# Altium schematic sheet Light_Circuit.SchDoc
size A
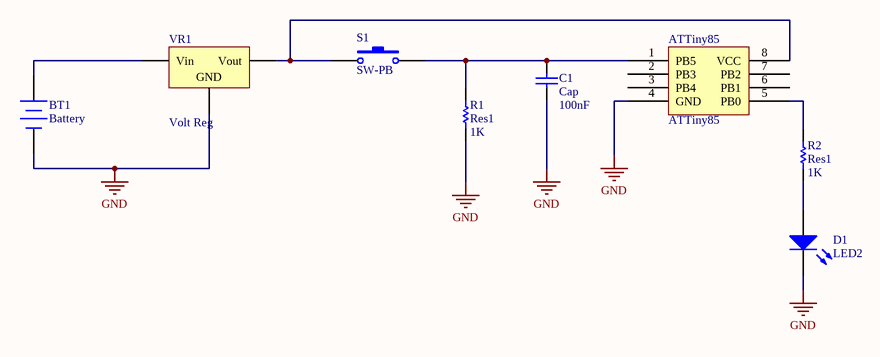
[diagram p0: Light_Circuit.SchDoc]

## Parts
ATTiny85  ATTiny85  [8S2]
BT1  Battery  [BAT-2]
C1  Cap  value 100nF  [RAD-0.3]
D1  LED2  [3.2X1.6X1.1]
R1  Res1  value 1K  [AXIAL-0.3]
R2  Res1  value 1K  [AXIAL-0.3]
S1  SW-PB  [SPST-2]
VR1  Volt Reg  [D2PAK_N]

## Nets
GND: ATTiny85.4(GND) BT1.2(-) C1.2 D1.2(K) R1.1 VR1.2(GND)
NetATTiny85_1: ATTiny85.1(PB5) C1.1 R1.2 S1.2
NetATTiny85_5: ATTiny85.5(PB0) R2.2
NetATTiny85_8: ATTiny85.8(VCC) S1.1 VR1.3(Vout)
NetBT1_1: BT1.1(+) VR1.1(Vin)
NetD1_1: D1.1(A) R2.1

Not connected (* = marked no-connect by the designer): ATTiny85 2(PB3) 3(PB4) 6(PB1) 7(PB2)

## Library data of the parts
ATTiny85 = ATTiny85_1
BT1 = Battery: Multicell Battery; Published: 24-Mar-1999; LatestRevisionDate: 17-Jul-2002; LatestRevisionNote: Re-released for DXP Platform.; PackageReference: BAT-2; Publisher: Altium Limited; PackageDescription: Battery; 2 Leads
C1 = Cap: Capacitor; Published: 8-Jun-2000; LatestRevisionDate: 17-Jul-2002; LatestRevisionNote: Re-released for DXP Platform.; PackageReference: RAD-0.3; Publisher: Altium Limited; PackageDescription: Radial Cap, Thru-Hole; 2 Leads; 0.3 in Pin Spacing
D1 = LED2: Typical RED, GREEN, YELLOW, AMBER GaAs LED; Published: 8-Jun-2000; LatestRevisionDate: 17-Jul-2002; LatestRevisionNote: Re-released for DXP Platform.; PackageVersion: Feb-2002; PackageReference: 3.2X1.6X1.1; Publisher: Altium Limited; PackageDescription: SM LED; 2 Flat Leads
R1 R2 = Res1: Resistor; Published: 8-Jun-2000; LatestRevisionDate: 17-Jul-2002; LatestRevisionNote: Re-released for DXP Platform.; PackageReference: AXIAL-0.3; Publisher: Altium Limited; PackageDescription: Axial Device, Thru-Hole; 2 Leads; 0.3 in Pin Spacing
S1 = SW-PB: Switch; Published: 24-Mar-1999; LatestRevisionDate: 17-Jul-2002; LatestRevisionNote: Re-released for DXP Platform.; PackageReference: SPST-2; Publisher: Altium Limited; PackageDescription: Switch; 2 Leads
VR1 = Volt Reg: Voltage Regulator; Published: 24-Mar-1999; LatestRevisionDate: 29-May-2009; LatestRevisionNote: IPC-7351 Footprint Added.; PackageReference: D2PAK; Publisher: Altium Limited; PackageDescription: 3-Pin Transistor Outline Package 2.54 mm Pitch, 15.1 mm Lead Span